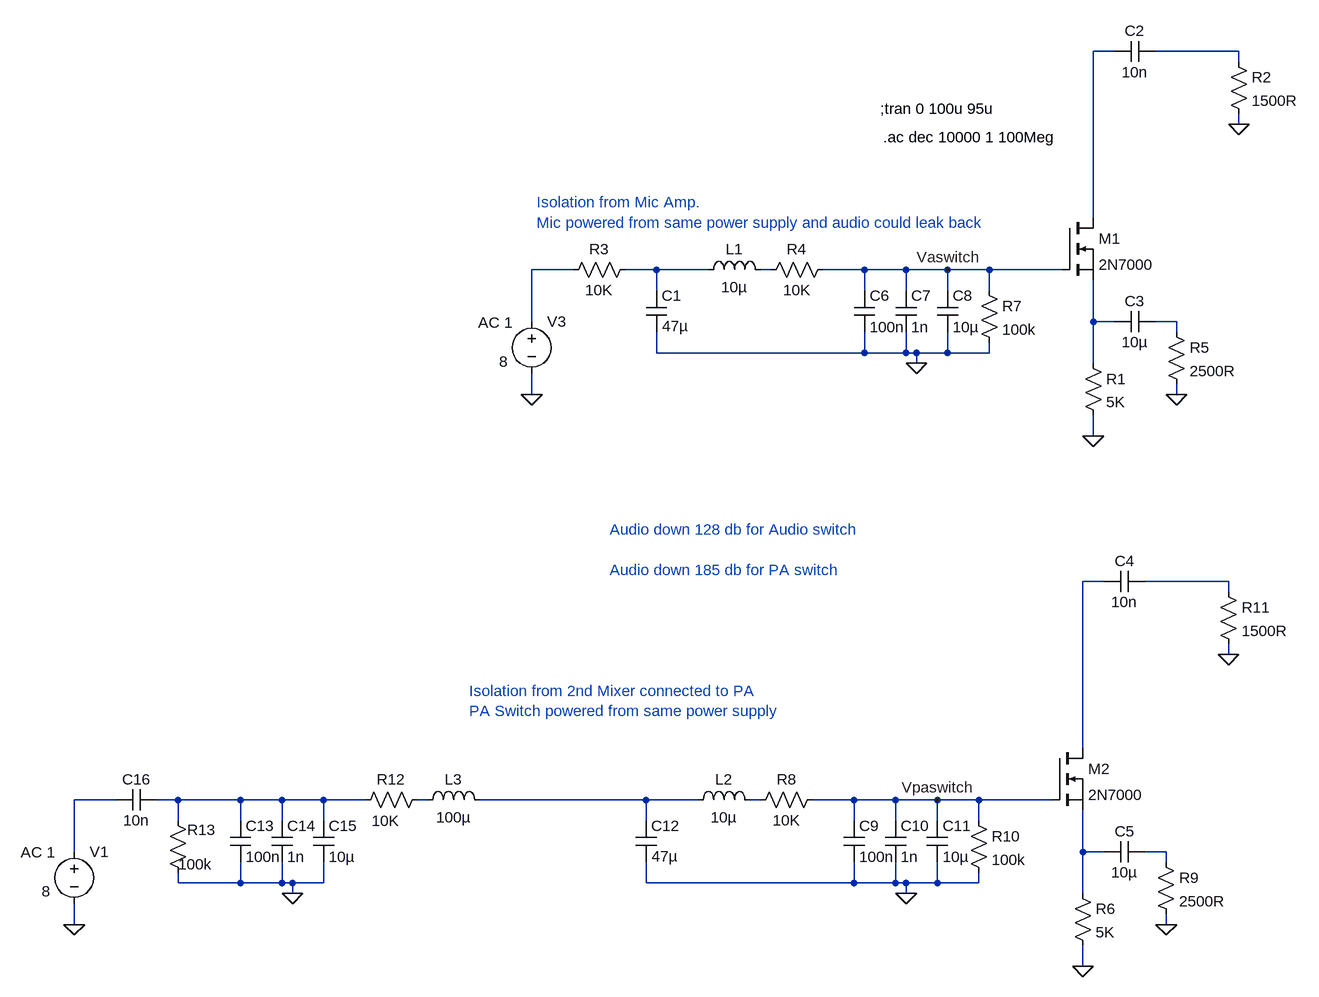
[diagram p0: schematic FET Switch Decoupling Test.asc]
FET Switch Decoupling Test.asc, the LTspice schematic file:
Version 4
SHEET 1 1176 1300
WIRE 192 -128 160 -128
WIRE 384 -128 256 -128
WIRE 384 -112 384 -128
WIRE 384 -16 384 -32
WIRE 160 128 160 -128
WIRE -640 208 -704 208
WIRE -512 208 -560 208
WIRE -432 208 -512 208
WIRE -336 208 -352 208
WIRE -192 208 -256 208
WIRE -128 208 -192 208
WIRE -64 208 -128 208
WIRE 0 208 -64 208
WIRE 112 208 0 208
WIRE -512 240 -512 208
WIRE -192 240 -192 208
WIRE -128 240 -128 208
WIRE -64 240 -64 208
WIRE 0 240 0 208
WIRE -704 288 -704 208
WIRE 160 288 160 224
WIRE 192 288 160 288
WIRE 288 288 256 288
WIRE 288 304 288 288
WIRE -512 336 -512 304
WIRE -192 336 -192 304
WIRE -192 336 -512 336
WIRE -128 336 -128 304
WIRE -128 336 -192 336
WIRE -112 336 -128 336
WIRE -64 336 -64 304
WIRE -64 336 -112 336
WIRE 0 336 0 320
WIRE 0 336 -64 336
WIRE -112 352 -112 336
WIRE 160 352 160 288
WIRE -704 400 -704 368
WIRE 288 400 288 384
WIRE 160 464 160 432
WIRE 176 688 144 688
WIRE 368 688 240 688
WIRE 368 704 368 688
WIRE 368 800 368 784
WIRE 144 944 144 688
WIRE -1344 1024 -1408 1024
WIRE -1248 1024 -1280 1024
WIRE -1152 1024 -1248 1024
WIRE -1088 1024 -1152 1024
WIRE -1024 1024 -1088 1024
WIRE -960 1024 -1024 1024
WIRE -864 1024 -880 1024
WIRE -528 1024 -784 1024
WIRE -448 1024 -528 1024
WIRE -352 1024 -368 1024
WIRE -208 1024 -272 1024
WIRE -144 1024 -208 1024
WIRE -80 1024 -144 1024
WIRE -16 1024 -80 1024
WIRE 96 1024 -16 1024
WIRE -1248 1056 -1248 1024
WIRE -1152 1056 -1152 1024
WIRE -1088 1056 -1088 1024
WIRE -1024 1056 -1024 1024
WIRE -528 1056 -528 1024
WIRE -208 1056 -208 1024
WIRE -144 1056 -144 1024
WIRE -80 1056 -80 1024
WIRE -16 1056 -16 1024
WIRE -1408 1104 -1408 1024
WIRE 144 1104 144 1040
WIRE 176 1104 144 1104
WIRE 272 1104 240 1104
WIRE 272 1120 272 1104
WIRE -1248 1152 -1248 1136
WIRE -1152 1152 -1152 1120
WIRE -1152 1152 -1248 1152
WIRE -1088 1152 -1088 1120
WIRE -1088 1152 -1152 1152
WIRE -1072 1152 -1088 1152
WIRE -1024 1152 -1024 1120
WIRE -1024 1152 -1072 1152
WIRE -528 1152 -528 1120
WIRE -208 1152 -208 1120
WIRE -208 1152 -528 1152
WIRE -144 1152 -144 1120
WIRE -144 1152 -208 1152
WIRE -128 1152 -144 1152
WIRE -80 1152 -80 1120
WIRE -80 1152 -128 1152
WIRE -16 1152 -16 1136
WIRE -16 1152 -80 1152
WIRE -1072 1168 -1072 1152
WIRE -128 1168 -128 1152
WIRE 144 1168 144 1104
WIRE -1408 1216 -1408 1184
WIRE 272 1216 272 1200
WIRE 144 1280 144 1248
FLAG 160 464 0
FLAG -704 400 0
FLAG 288 400 0
FLAG -112 352 0
FLAG 384 -16 0
FLAG 144 1280 0
FLAG -1408 1216 0
FLAG 272 1216 0
FLAG -128 1168 0
FLAG 368 800 0
FLAG -1072 1168 0
FLAG -64 208 Vaswitch
FLAG -80 1024 Vpaswitch
SYMBOL nmos 112 128 R0
SYMATTR InstName M1
SYMATTR Value 2N7000
SYMBOL res 144 336 R0
SYMATTR InstName R1
SYMATTR Value 5K
SYMBOL voltage -704 272 R0
WINDOW 3 -50 77 Left 2
WINDOW 123 -82 17 Left 2
WINDOW 39 0 0 Left 2
SYMATTR Value 8
SYMATTR Value2 AC 1
SYMATTR InstName V3
SYMBOL res -240 192 R90
WINDOW 0 0 56 VBottom 2
WINDOW 3 32 56 VTop 2
SYMATTR InstName R4
SYMATTR Value 10K
SYMBOL cap 256 -144 R90
WINDOW 0 0 32 VBottom 2
WINDOW 3 32 32 VTop 2
SYMATTR InstName C2
SYMATTR Value 10n
SYMBOL cap 256 272 R90
WINDOW 0 0 32 VBottom 2
WINDOW 3 32 32 VTop 2
SYMATTR InstName C3
SYMATTR Value 10µ
SYMBOL res 272 288 R0
SYMATTR InstName R5
SYMATTR Value 2500R
SYMBOL ind -448 224 R270
WINDOW 0 32 56 VTop 2
WINDOW 3 5 56 VBottom 2
SYMATTR InstName L1
SYMATTR Value 10µ
SYMBOL cap -208 240 R0
SYMATTR InstName C6
SYMATTR Value 100n
SYMBOL cap -144 240 R0
SYMATTR InstName C7
SYMATTR Value 1n
SYMBOL cap -80 240 R0
SYMATTR InstName C8
SYMATTR Value 10µ
SYMBOL res -16 224 R0
SYMATTR InstName R7
SYMATTR Value 100k
SYMBOL res 368 -128 R0
SYMATTR InstName R2
SYMATTR Value 1500R
SYMBOL cap -528 240 R0
WINDOW 3 25 55 Left 2
SYMATTR InstName C1
SYMATTR Value 47µ
SYMBOL res -544 192 R90
WINDOW 0 0 56 VBottom 2
WINDOW 3 32 56 VTop 2
SYMATTR InstName R3
SYMATTR Value 10K
SYMBOL nmos 96 944 R0
SYMATTR InstName M2
SYMATTR Value 2N7000
SYMBOL res 128 1152 R0
SYMATTR InstName R6
SYMATTR Value 5K
SYMBOL voltage -1408 1088 R0
WINDOW 3 -50 77 Left 2
WINDOW 123 -82 17 Left 2
WINDOW 39 0 0 Left 2
SYMATTR Value 8
SYMATTR Value2 AC 1
SYMATTR InstName V1
SYMBOL res -256 1008 R90
WINDOW 0 0 56 VBottom 2
WINDOW 3 32 56 VTop 2
SYMATTR InstName R8
SYMATTR Value 10K
SYMBOL cap 240 672 R90
WINDOW 0 0 32 VBottom 2
WINDOW 3 32 32 VTop 2
SYMATTR InstName C4
SYMATTR Value 10n
SYMBOL cap 240 1088 R90
WINDOW 0 0 32 VBottom 2
WINDOW 3 32 32 VTop 2
SYMATTR InstName C5
SYMATTR Value 10µ
SYMBOL res 256 1104 R0
SYMATTR InstName R9
SYMATTR Value 2500R
SYMBOL ind -464 1040 R270
WINDOW 0 32 56 VTop 2
WINDOW 3 5 56 VBottom 2
SYMATTR InstName L2
SYMATTR Value 10µ
SYMBOL cap -224 1056 R0
SYMATTR InstName C9
SYMATTR Value 100n
SYMBOL cap -160 1056 R0
SYMATTR InstName C10
SYMATTR Value 1n
SYMBOL cap -96 1056 R0
SYMATTR InstName C11
SYMATTR Value 10µ
SYMBOL res -32 1040 R0
SYMATTR InstName R10
SYMATTR Value 100k
SYMBOL res 352 688 R0
SYMATTR InstName R11
SYMATTR Value 1500R
SYMBOL cap -544 1056 R0
WINDOW 3 25 55 Left 2
SYMATTR InstName C12
SYMATTR Value 47µ
SYMBOL res -864 1008 R90
WINDOW 0 0 56 VBottom 2
WINDOW 3 33 65 VTop 2
SYMATTR InstName R12
SYMATTR Value 10K
SYMBOL cap -1168 1056 R0
SYMATTR InstName C13
SYMATTR Value 100n
SYMBOL cap -1104 1056 R0
SYMATTR InstName C14
SYMATTR Value 1n
SYMBOL cap -1040 1056 R0
SYMATTR InstName C15
SYMATTR Value 10µ
SYMBOL res -1264 1040 R0
WINDOW 0 30 30 Left 2
WINDOW 3 16 83 Left 2
SYMATTR InstName R13
SYMATTR Value 100k
SYMBOL cap -1280 1008 R90
WINDOW 0 0 32 VBottom 2
WINDOW 3 32 32 VTop 2
SYMATTR InstName C16
SYMATTR Value 10n
SYMBOL ind -880 1040 R270
WINDOW 0 32 56 VTop 2
WINDOW 3 5 56 VBottom 2
SYMATTR InstName L3
SYMATTR Value 100µ
TEXT -168 -40 Left 2 !;tran 0 100u 95u
TEXT -163 4 Left 2 !.ac dec 10000 1 100Meg
TEXT -696 104 Left 2 ;Isolation from Mic Amp.\nMic powered from same power supply and audio could leak back
TEXT -800 856 Left 2 ;Isolation from 2nd Mixer connected to PA\nPA Switch powered from same power supply
TEXT -584 608 Left 2 ;Audio down 128 db for Audio switch\n \nAudio down 185 db for PA switch

The netlist it stands for:
* FET Switch Decoupling Test.asc
M1 N001 Vaswitch N006 N006 2N7000
R1 N006 0 5K
V3 N003 0 8 AC 1
R4 Vaswitch N005 10K
C2 N002 N001 10n
C3 N007 N006 10µ
R5 N007 0 2500R
L1 N004 N005 10µ
C6 Vaswitch 0 100n
C7 Vaswitch 0 1n
C8 Vaswitch 0 10µ
R7 Vaswitch 0 100k
R2 N002 0 1500R
C1 N004 0 47µ
R3 N004 N003 10K
M2 N008 Vpaswitch N015 N015 2N7000
R6 N015 0 5K
V1 N010 0 8 AC 1
R8 Vpaswitch N014 10K
C4 N009 N008 10n
C5 N016 N015 10µ
R9 N016 0 2500R
L2 N013 N014 10µ
C9 Vpaswitch 0 100n
C10 Vpaswitch 0 1n
C11 Vpaswitch 0 10µ
R10 Vpaswitch 0 100k
R11 N009 0 1500R
C12 N013 0 47µ
R12 N012 N011 10K
C13 N011 0 100n
C14 N011 0 1n
C15 N011 0 10µ
R13 N011 0 100k
C16 N011 N010 10n
L3 N012 N013 100µ
.model NMOS NMOS
.model PMOS PMOS
.lib standard.mos
;tran 0 100u 95u
.ac dec 10000 1 100Meg
* Isolation from Mic Amp.
* Mic powered from same power supply and audio could leak back
* Isolation from 2nd Mixer connected to PA
* PA Switch powered from same power supply
* Audio down 128 db for Audio switch
* Audio down 185 db for PA switch
.backanno
.end